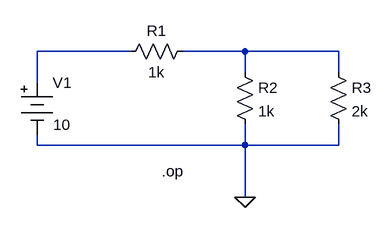
[diagram p0: schematic Draft1.asc]
Draft1.asc, the LTspice schematic file:
Version 4
SHEET 1 880 680
WIRE 64 0 -80 0
WIRE 240 0 144 0
WIRE 384 0 240 0
WIRE 240 32 240 0
WIRE 384 32 384 0
WIRE -80 48 -80 0
WIRE -80 144 -80 128
WIRE 240 144 240 112
WIRE 240 144 -80 144
WIRE 384 144 384 112
WIRE 384 144 240 144
WIRE 240 224 240 144
FLAG 240 224 0
SYMBOL res 48 16 R270
WINDOW 0 32 56 VTop 2
WINDOW 3 0 56 VBottom 2
SYMATTR InstName R1
SYMATTR Value 1k
SYMBOL res 224 16 R0
SYMATTR InstName R2
SYMATTR Value 1k
SYMBOL res 368 16 R0
SYMATTR InstName R3
SYMATTR Value 2k
SYMBOL Misc\\battery -80 32 R0
WINDOW 3 25 81 Left 2
WINDOW 123 0 0 Left 0
WINDOW 39 0 0 Left 0
SYMATTR Value 10
SYMATTR InstName V1
TEXT 112 184 Left 2 !.op

The netlist it stands for:
* Draft1.asc
R1 N001 N002 1k
R2 N002 0 1k
R3 N002 0 2k
V1 N001 0 10
.op
.backanno
.end